# EAGLE design ll4-gun (EAGLE 5.10)
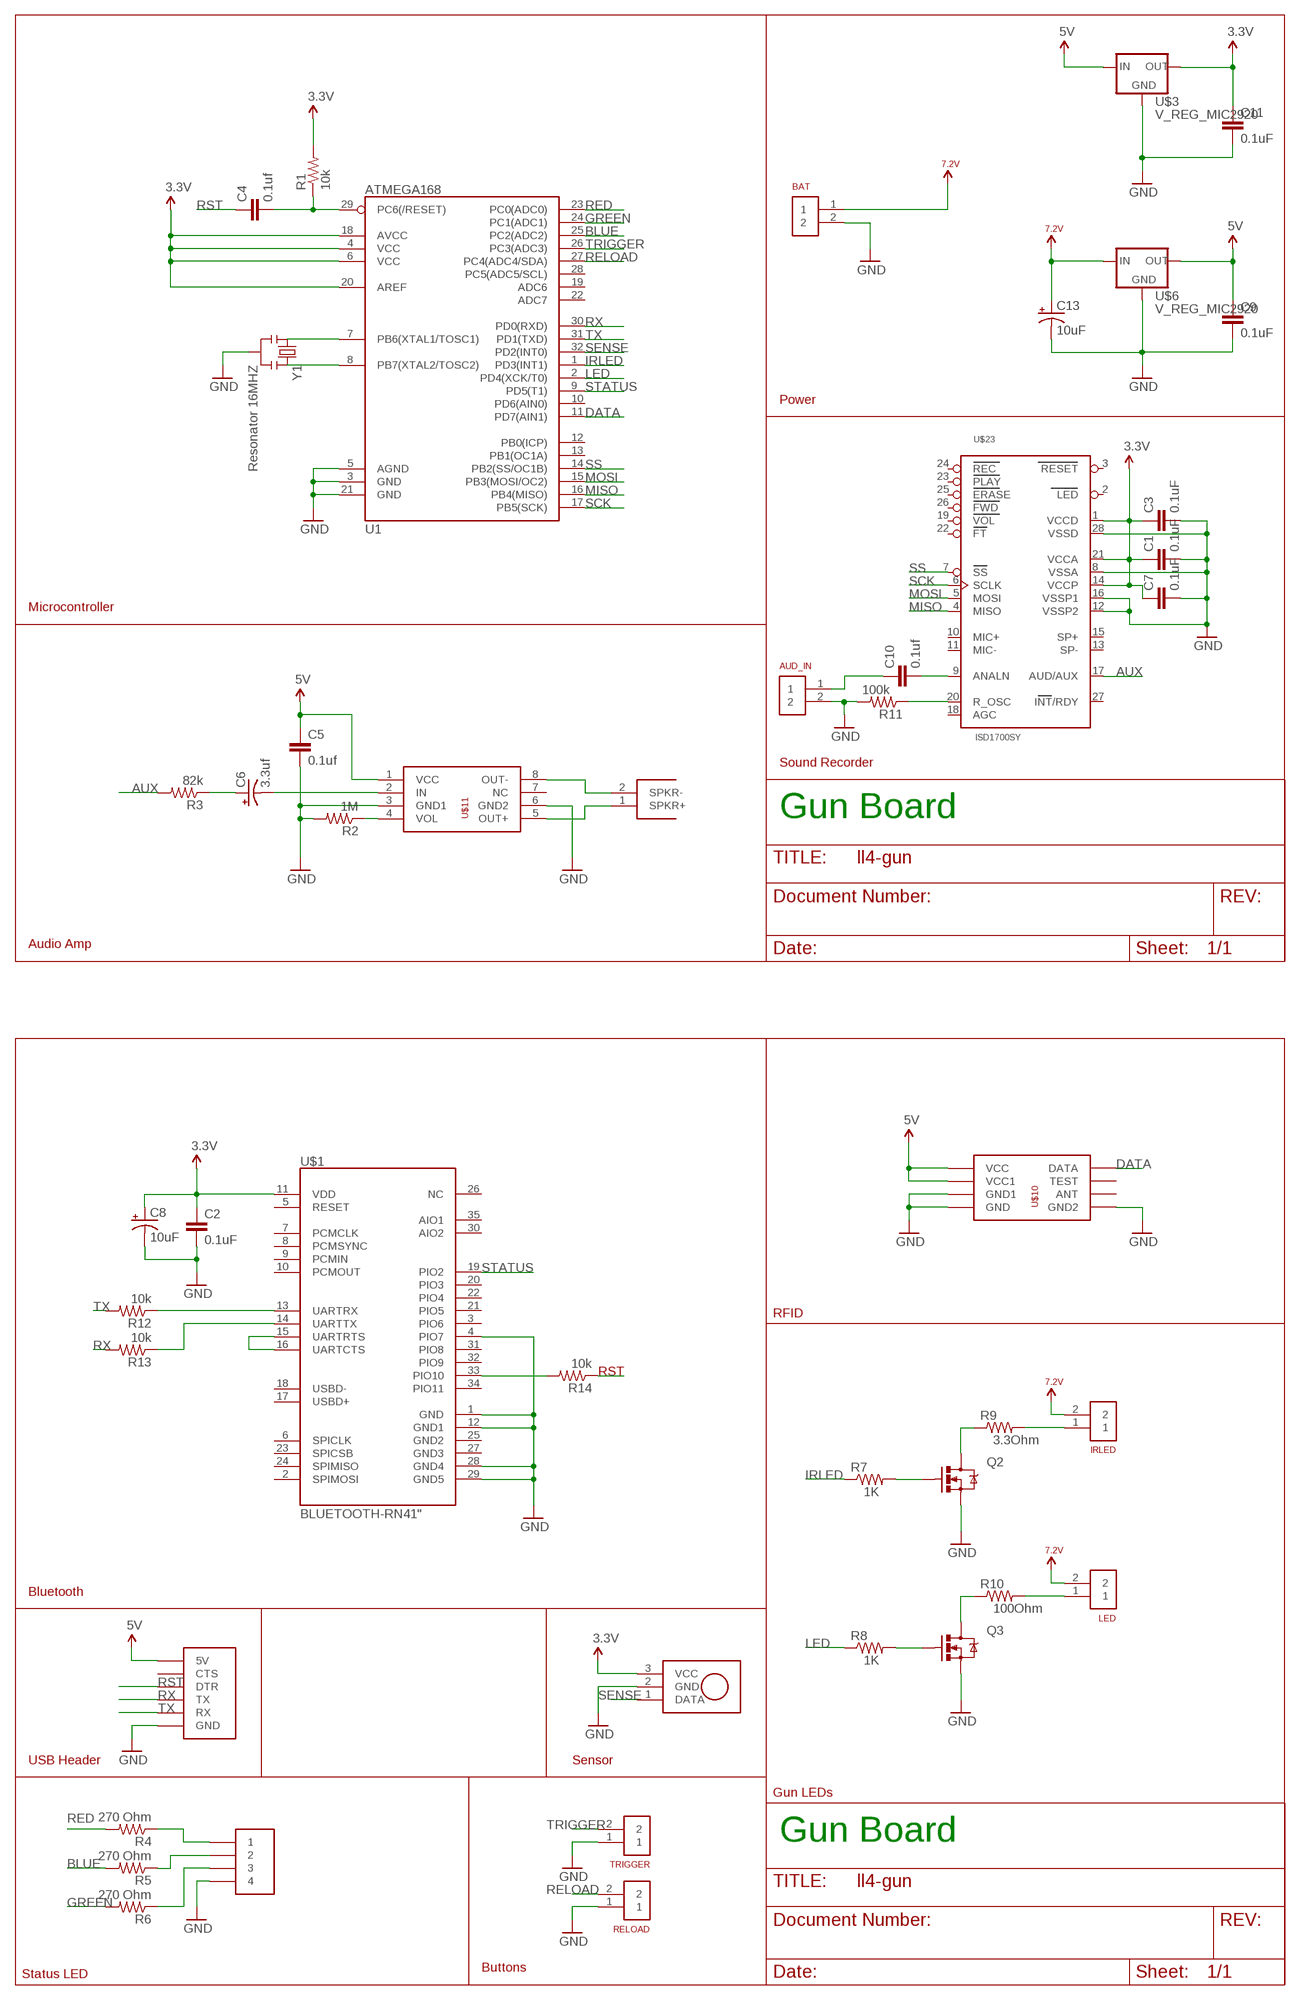
[diagram p0: schematic, sheet 1]

## Parts
AUD_IN  2HEAD  [2HEAD]
BAT  2HEAD  [2HEAD]
C1  0.1uF  CAP0805  [0805]
C2  0.1uF  CAP0805  [0805]
C3  0.1uF  CAP0805  [0805]
C4  0.1uf  CAP0805  [0805]
C5  0.1uf  CAP0805  [0805]
C6  3.3uf  CAP_POL1206-KIT  [EIA3216-KIT]
C7  0.1uF  CAP0805  [0805]
C8  10uF  CAP_POL1206  [EIA3216]
C9  0.1uF  CAP0805  [0805]
C10  0.1uf  CAP0805  [0805]
C11  0.1uF  CAP0805  [0805]
C13  10uF  CAP_POL1206  [EIA3216]
IRLED  2HEAD  [2HEAD]
LED  2HEAD  [2HEAD]
Q2  MOSFET-NCHANNELSMD  [SOT23-3]
Q3  MOSFET-NCHANNELSMD  [SOT23-3]
R1  10k  RESISTOR0805-RES  [0805]
R2  1M  RESISTOR0805-RES  [0805]
R3  82k  RESISTOR0805-RES  [0805]
R4  270 Ohm  RESISTOR0805-RES  [0805]
R5  270 Ohm  RESISTOR0805-RES  [0805]
R6  270 Ohm  RESISTOR0805-RES  [0805]
R7  1K  RESISTOR0805-RES  [0805]
R8  1K  RESISTOR0805-RES  [0805]
R9  3.3Ohm  RESISTORPTH-1/2W  [AXIAL-0.5]
R10  100Ohm  RESISTORPTH-1/2W  [AXIAL-0.5]
R11  100k  RESISTOR0805-RES  [0805]
R12  10k  RESISTOR0805-RES  [0805]
R13  10k  RESISTOR0805-RES  [0805]
R14  10k  RESISTOR0805-RES  [0805]
RELOAD  2HEAD  [2HEAD]
SPEAKER  SPKRHEAD  [SPKRHEAD]
TRIGGER  2HEAD  [2HEAD]
U1  ATMEGA168  [TQFP32-08]
U$1  BLUETOOTH-RN41"  [RN41]
U$3  V_REG_MIC2920  [SOT223]
U$6  V_REG_MIC2920  [SOT223]
U$10  RFLINK-RCV  [RFLINK-RCV]
U$11  TDA7052B  [DIP08]
U$13  TSOP48XX  [TSOP48XX]
U$16  4HEAD  [4HEAD]
U$20  USBHEAD  [USBHEAD]
U$23  ISD1700SY  [SO28W]
Y1  Resonator 16MHZ  RESONATORPTH  [RESONATOR-PTH]

## Nets
3.3V: C1.1 C2.1 C3.1 C7.1 C8.A(+) C11.1 R1.2 U1.4(VCC) U1.6(VCC) U1.18(AVCC) U1.20(AREF) U$1.11(VDD) U$3.3(OUT) U$13.3(VCC) U$23.1(VCCD) U$23.14(VCCP) U$23.21(VCCA)
5V: C5.1 C9.1 U$3.1(IN) U$6.3(OUT) U$10.VCC1(VCC) U$10.VCC(VCC1) U$11.1(VCC) U$20.3(5V)
7.2V: BAT.1 C13.A(+) IRLED.2 LED.2 U$6.1(IN)
AUX: R3.2 U$23.17(AUD/AUX)
BLUE: R5.2 U1.25(PC2(ADC2))
DATA: U1.11(PD7(AIN1)) U$10.DATA
GND: AUD_IN.2 BAT.2 C1.2 C2.2 C3.2 C5.2 C7.2 C8.C(-) C9.2 C11.2 C13.C(-) Q2.2(S) Q3.2(S) R2.2 R11.2 RELOAD.1 TRIGGER.1 U1.3(GND) U1.5(AGND) U1.21(GND) U$1.1(GND) U$1.4(PIO7) U$1.12(GND1) U$1.28(GND4) U$1.29(GND5) U$3.2(GND) U$6.2(GND) U$10.GND1(GND2) U$10.GND2(GND) U$10.GND(GND1) U$11.3(GND1) U$11.6(GND2) U$13.2(GND) U$16.4 U$20.1(GND) U$23.8(VSSA) U$23.12(VSSP2) U$23.16(VSSP1) U$23.28(VSSD) Y1.2
GREEN: R6.2 U1.24(PC1(ADC1))
IRLED: R7.1 U1.1(PD3(INT1))
LED: R8.1 U1.2(PD4(XCK/T0))
LINK: U$1.15(UARTRTS) U$1.16(UARTCTS)
MISO: U1.16(PB4(MISO)) U$23.4(MISO)
MOSI: U1.15(PB3(MOSI/OC2)) U$23.5(MOSI)
N$1: U1.7(PB6(XTAL1/TOSC1)) Y1.1
N$2: U1.8(PB7(XTAL2/TOSC2)) Y1.3
N$3: R12.1 U$1.13(UARTRX)
N$4: SPEAKER.2(SPKR-) U$11.8(OUT-)
N$5: SPEAKER.1(SPKR+) U$11.5(OUT+)
N$6: R2.1 U$11.4(VOL)
N$7: C6.C(-) U$11.2(IN)
N$8: C6.A(+) R3.1
N$9: R13.1 U$1.14(UARTTX)
N$10: R4.1 U$16.1
N$11: R5.1 U$16.2
N$12: R6.1 U$16.3
N$13: C4.2 R1.1 U1.29(PC6(/RESET))
N$14: Q2.1(G) R7.2
N$15: Q3.1(G) R8.2
N$16: IRLED.1 R9.P$2
N$17: LED.1 R10.P$2
N$18: Q3.3(D) R10.P$1
N$19: R11.1 U$23.20(R_OSC)
N$20: Q2.3(D) R9.P$1
N$21: C10.2 U$23.9(ANALN)
N$22: AUD_IN.1 C10.1
N$23: R14.2 U$1.33(PIO10)
RED: R4.2 U1.23(PC0(ADC0))
RELOAD: RELOAD.2 U1.27(PC4(ADC4/SDA))
RST: C4.1 R14.1 U$20.6(DTR)
RX: R13.2 U1.30(PD0(RXD)) U$20.4(TX)
SCK: U1.17(PB5(SCK)) U$23.6(SCLK)
SENSE: U1.32(PD2(INT0)) U$13.1(DATA)
SS: U1.14(PB2(SS/OC1B)) U$23.7(SS)
STATUS: U1.9(PD5(T1)) U$1.19(PIO2)
TRIGGER: TRIGGER.2 U1.26(PC3(ADC3))
TX: R12.2 U1.31(PD1(TXD)) U$20.5(RX)
Unconnected: U1.10(PD6(AIN0)) U1.12(PB0(ICP)) U1.13(PB1(OC1A)) U1.19(ADC6) U1.22(ADC7) U1.28(PC5(ADC5/SCL)) U$1.2(SPIMOSI) U$1.3(PIO6) U$1.5(RESET) U$1.6(SPICLK) U$1.7(PCMCLK) U$1.8(PCMSYNC) U$1.9(PCMIN) U$1.10(PCMOUT) U$1.17(USBD+) U$1.18(USBD-) U$1.20(PIO3) U$1.21(PIO5) U$1.22(PIO4) U$1.23(SPICSB) U$1.24(SPIMISO) U$1.25(GND2) U$1.26(NC) U$1.27(GND3) U$1.30(AIO2) U$1.31(PIO8) U$1.32(PIO9) U$1.34(PIO11) U$1.35(AIO1) U$10.ANT U$10.TEST U$11.7(NC) U$20.2(CTS) U$23.2(LED) U$23.3(RESET) U$23.10(MIC+) U$23.11(MIC-) U$23.13(SP-) U$23.15(SP+) U$23.18(AGC) U$23.19(VOL) U$23.22(FT) U$23.23(PLAY) U$23.24(REC) U$23.25(ERASE) U$23.26(FWD) U$23.27(INT/RDY)

## Notes on the sheet
- Power
- Microcontroller
- Sound Recorder
- Gun Board
- Audio Amp
- RFID
- Bluetooth
- USB Header | Sensor
- Gun LEDs
- Gun Board
- Buttons
- Status LED

## Library data of the parts
AUD_IN BAT IRLED LED RELOAD TRIGGER = custom:2HEAD
C1-C5 C7 C9-C11 = sparkfun:CAP: Capacitor Standard 0603 ceramic capacitor, and 0.1" leaded capacitor.
C6 C8 C13 = sparkfun:CAP_POL: Capacitor Polarized These are standard SMD and PTH capacitors. Normally 10uF, 47uF, and 100uF in electrolytic and tantalum varieties. Always verify the external diameter of the through hole cap, it varies with capacity, voltage, and manufacturer. The EIA devices should be standard.
Q2 Q3 = sparkfun:MOSFET-NCHANNEL
R1-R14 = sparkfun:RESISTOR: Resistor Basic schematic elements and footprints for 0603, 1206, and PTH resistors.
SPEAKER = custom:SPKRHEAD
U1 = sparkfun:ATMEGA168
U$1 = sparkfun:BLUETOOTH-RN41
U$3 U$6 = sparkfun:V_REG_MIC2920: MIC2920A (http://www.micrel.com/_PDF/mic2920.pdf) - 400mA output LDO Regulator
U$10 = custom:RFLINK-RCV
U$11 = custom:TDA7052B
U$13 = custom:TSOP48XX
U$16 = custom:4HEAD
U$20 = custom:USBHEAD
U$23 = isd-new-1:ISD1700
Y1 = sparkfun:RESONATOR: Resonator Small SMD resonator. This is the itty bitty 10/20MHz resonators with built in caps. CSTCE10M0G55 and CSTCE20M0V53. Footprint has been reviewed closely but hasn't been tested yet.

## Board
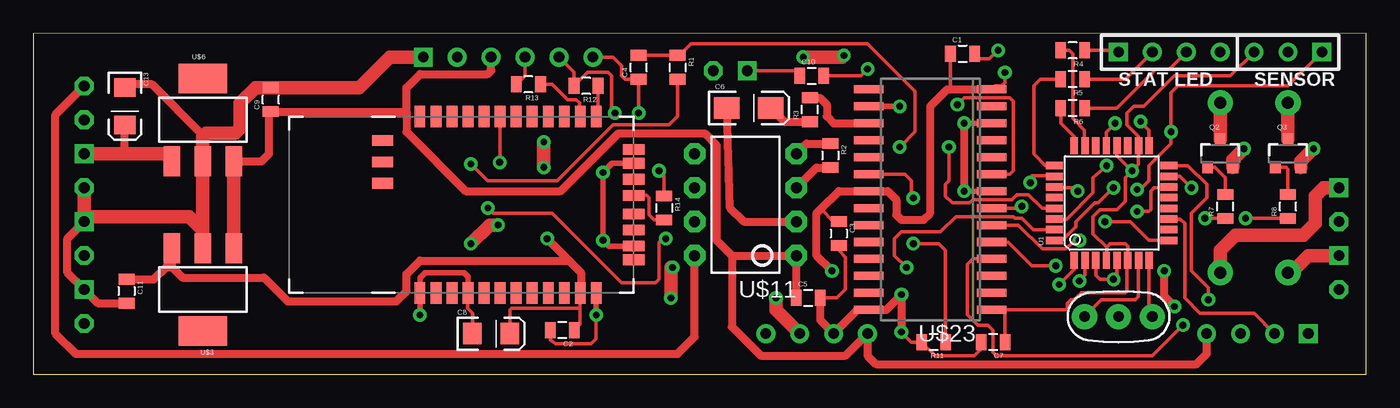
[diagram p1: board, top side]
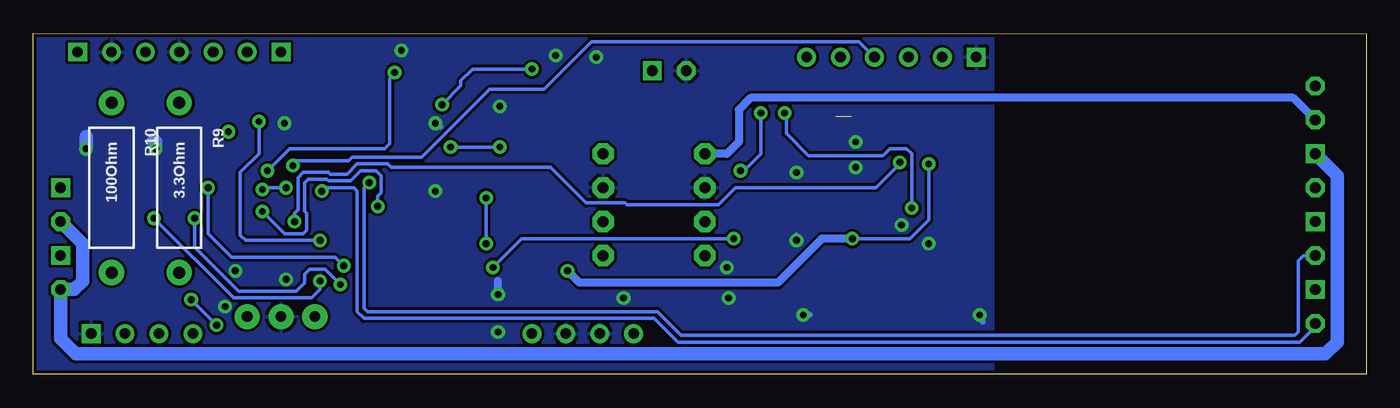
[diagram p2: board, bottom side, seen from below]

Size 99.83 x 25.53 mm. Coordinates in mm from the lower left corner, seen from the top.
Outline: 0,0 99.83,0 99.83,25.53 0,25.52 0,0
Copper layers (1*16): Top 0.035mm / dielectric 1.5mm / Bottom 0.035mm
Design rules "SparkFun": minimum track width 8mil, minimum drill 20mil, track to track 8mil, track to pad 8mil, pad to pad 8mil, via to via 8mil, smd to smd 8mil, copper to edge 10mil, drill to drill 8mil, minimum pad ring 12mil, minimum via ring 10mil, stop-mask expansion 4mil, vias tented up to drill 25mil, thermal gap 10mil

### Footprints (pad centres in the part's own frame; a part is rotated, then mirrored left to right if it is on the bottom)
2HEAD = drill 0.8 square: 1 -1.27,0 | drill 0.8 octagon: 2 1.27,0
0805 = smd 0.8 x 1.2: 1 -0.9,0; 2 0.9,0
EIA3216-KIT = smd 1.9 x 1.6: A 1.65,0; C -1.65,0
EIA3216 = smd 1.4 x 1.6: A 1.4,0; C -1.4,0
SOT23-3 = smd 0.8 x 0.9: 1 -0.95,-1; 2 0.95,-1; 3 0,1.1
AXIAL-0.5 = drill 0.9 pad 1.88 round: P$1 -6.35,0; P$2 6.35,0
SPKRHEAD = drill 0.8 octagon: 1 -1.27,0; 2 1.27,0
TQFP32-08 = smd 1.27 x 0.559: 1 -4.293,2.8; 2 -4.293,2; 3 -4.293,1.2; 4 -4.293,0.4; 5 -4.293,-0.4; 6 -4.293,-1.2; 7 -4.293,-2; 8 -4.293,-2.8; 17 4.293,-2.8; 18 4.293,-2; 19 4.293,-1.2; 20 4.293,-0.4; 21 4.293,0.4; 22 4.293,1.2; 23 4.293,2; 24 4.293,2.8 | smd 0.559 x 1.27: 9 -2.8,-4.293; 10 -2,-4.293; 11 -1.2,-4.293; 12 -0.4,-4.293; 13 0.4,-4.293; 14 1.2,-4.293; 15 2,-4.293; 16 2.8,-4.293; 25 2.8,4.293; 26 2,4.293; 27 1.2,4.293; 28 0.4,4.293; 29 -0.4,4.293; 30 -1.2,4.293; 31 -2,4.293; 32 -2.8,4.293
RN41 = smd 0.8 x 1.6: 1 -6.6,-6.6; 2 -5.4,-6.6; 3 -4.2,-6.6; 4 -3,-6.6; 5 -1.8,-6.6; 6 -0.6,-6.6; 7 0.6,-6.6; 8 1.8,-6.6; 9 3,-6.6; 10 4.2,-6.6; 11 5.4,-6.6; 12 6.6,-6.6; 13 6.6,6.6; 14 5.4,6.6; 15 4.2,6.6; 16 3,6.6; 17 1.8,6.6; 18 0.6,6.6; 19 -0.6,6.6; 20 -1.8,6.6; 21 -3,6.6; 22 -4.2,6.6; 23 -5.4,6.6; 24 -6.6,6.6 | smd 1.6 x 0.8: 25 -9.4,4.8; 26 -9.4,3.2; 27 -9.4,1.6; 28 9.4,3.1; 29 9.4,-3.1; 30 9.4,-4.122; 31 9.4,-1.9; 32 9.4,-0.7; 33 9.4,0.7; 34 9.4,1.9; 35 9.4,4.122
SOT223 = smd 1.219 x 2.235: 1 -2.311,-3.099; 2 0,-3.099; 3 2.311,-3.099 | smd 3.6 x 2.2: 4 0,3.099
RFLINK-RCV = drill 0.8 round: ANT 21.59,0; DATA -16.51,0; GND1 16.51,0; GND2 19.05,0; TEST -13.97,0; VCC -11.43,0; VCC1 13.97,0 | drill 0.8 square: GND -19.05,0
DIP08 = drill 0.813 pad 1.6 octagon: 1 -3.81,-3.81; 2 -1.27,-3.81; 3 1.27,-3.81; 4 3.81,-3.81; 5 3.81,3.81; 6 1.27,3.81; 7 -1.27,3.81; 8 -3.81,3.81
TSOP48XX = drill 0.8 square: 1 -2.54,0 | drill 0.8 round: 2 0,0; 3 2.54,0
4HEAD = drill 0.8 square: 1 -3.81,0 | drill 0.8 round: 2 -1.27,0; 3 1.27,0; 4 3.81,0
USBHEAD = drill 0.8 square: 1 -6.35,0 | drill 0.8 round: 2 -3.81,0; 3 -1.27,0; 4 1.27,0; 5 3.81,0; 6 6.35,0
SO28W = smd 0.6 x 2.2: 1 -8.255,-4.6; 2 -6.985,-4.6; 3 -5.715,-4.6; 4 -4.445,-4.6; 5 -3.175,-4.6; 6 -1.905,-4.6; 7 -0.635,-4.6; 8 0.635,-4.6; 9 1.905,-4.6; 10 3.175,-4.6; 11 4.445,-4.6; 12 5.715,-4.6; 13 6.985,-4.6; 14 8.255,-4.6; 15 8.255,4.6; 16 6.985,4.6; 17 5.715,4.6; 18 4.445,4.6; 19 3.175,4.6; 20 1.905,4.6; 21 0.635,4.6; 22 -0.635,4.6; 23 -1.905,4.6; 24 -3.175,4.6; 25 -4.445,4.6; 26 -5.715,4.6; 27 -6.985,4.6; 28 -8.255,4.6
RESONATOR-PTH = drill 0.8 pad 1.88 round: 1 -2.54,0; 2 0,0; 3 2.54,0

### Placement (x,y rotation side)
AUD_IN  52.2,22.73 180 top
BAT  3.81,15.24 270 top
C1  69.6,24 0 top
C2  39.62,3.3 180 top
C3  60.33,10.54 270 top
C4  45.34,22.99 90 top
C5  58.04,5.71 0 top
C6  53.59,19.94 0 top
C7  71.88,2.41 180 top
C8  34.29,3.05 0 top
C9  17.78,20.57 90 top
C10  58.29,22.35 0 top
C11  6.99,6.22 270 top
C13  6.86,20.07 270 top
IRLED  97.79,12.7 270 bottom
LED  97.79,7.62 270 bottom
Q2  88.9,16.51 0 top
Q3  93.98,16.51 0 top
R1  48.26,22.99 270 top
R2  59.69,16.38 270 top
R3  58.17,19.81 90 top
R4  77.85,24.26 180 top
R5  77.85,22.1 180 top
R6  77.85,19.94 180 top
R7  89.28,12.57 90 top
R8  93.98,12.57 90 top
R9  88.9,13.97 270 bottom
R10  93.98,13.97 270 bottom
R11  67.44,2.41 180 top
R12  41.4,21.59 180 top
R13  37.08,21.72 180 top
R14  47.24,12.45 270 top
RELOAD  3.81,5.08 270 top
SPEAKER  3.81,20.32 90 top
TRIGGER  3.81,10.16 270 top
U1  80.77,12.83 90 top
U$1  35.56,12.7 0 top
U$3  12.7,6.35 180 top
U$6  12.7,19.05 0 top
U$10  76.45,3.05 0 bottom
U$11  53.34,12.7 90 top
U$13  93.98,24.13 180 top
U$16  85.09,24.13 0 top
U$20  35.56,23.75 0 top
U$23  67.18,13.08 90 top
Y1  81.28,4.32 0 top

### Tracks (layer width: path | path; a pad name or v marks a point on that pad's centre or on a via)
3.3V  (via drill 0.51)
  Top 0.254: 80.39,9.53 80.64,9.78 81.79,9.78 81.97,9.6 U1.6 81.92,8.48 81.92,6.22 81.79,6.1 78.49,6.1 77.98,5.59 77.72,5.59 77.47,5.33 77.47,4.83 72.52,4.83 | 80.39,9.53 80.39,8.55 U1.4 | v82.3,15.24 82.77,15.72 U1.18 82.77,17.81 81.92,18.67 81.92,19.56 82.42,20.07 83.19,20.07 85.47,22.35 89.66,22.35 U$13.3 | U$1.11 40.96,4.95 | 40.96,4.95 40.96,3.74 C2.1 | 71.64,4.68 U$23.1 72.52,4.83 | C1.1 68.7,21.35 68.71,21.34 | C3.1 59.93,11.44 58.99,12.38 | 80.39,9.53 79.38,10.54 79.38,11.81 79.88,12.32 81.15,12.32 81.79,12.95 81.79,14.73 v82.3,15.24 | C8.A 35.69,4.83 35.81,4.95 40.96,4.95 | 81.15,17.1 81.15,16.38 v82.3,15.24 | v72.77,22.61 72.77,21.84 72.52,21.59 72.04,21.59 U$23.14 | R1.2 48.26,19.3 47.62,18.67 43.43,18.67 39.24,14.48 34.04,14.48 v32.77,15.75 | C7.1 72.78,4.56 72.52,4.83
  Top 0.406: 81.15,17.1 U1.20
  Top 0.61: 10.39,8.03 U$3.3 | 10.39,8.03 11.18,7.24 17.27,7.24 19.05,5.46 27.18,5.46 27.94,6.22 27.94,7.49 28.96,8.51 40.13,8.51 | 40.13,8.51 41.02,7.62 41.02,6.16 U$1.11 | 10.39,8.03 9.93,8.03 9.02,7.11 7.76,7.11 C11.1 | 40.13,8.51 v38.48,10.16 | U$23.14 68.71,21.34 68.45,21.34 67.18,20.07 67.18,12.06 66.67,11.56 65.02,11.56 64.64,11.94 64.64,13.08 64.01,13.72 U$23.21 60.33,13.72 58.99,12.38 58.67,12.06 58.67,8.89 v59.82,7.75
  Bottom 0.254: v82.3,15.24 80.64,16.89 73.53,16.89 73.15,17.27 73.15,22.1 v72.77,22.61 | v32.77,15.75 32.77,11.56 34.16,10.16 v38.48,10.16
  Bottom 0.61: v38.48,10.16 40.77,10.16 44.07,6.86 58.93,6.86 v59.82,7.75
5V
  Top 0.61: 52.32,8.89 51.18,10.03 51.18,17.14 50.29,18.03 43.81,18.03 39.5,13.72 32.38,13.72 27.94,18.16 27.94,19.68 | 52.32,8.89 U$11.1 57.14,8.88 C5.1 | 52.32,8.89 52.32,3.56 54.48,1.4 60.83,1.4 U$10.VCC1 62.48,1.4 63.12,0.76 87.12,0.76 87.88,1.52 U$10.VCC | U$20.3 34.29,22.73 34.04,22.48 28.96,22.48 27.94,21.46 27.94,19.68 | U$6.3 17.09,15.95 17.65,16.51 17.65,19.55 C9.1 27.93,19.67 27.94,19.68
  Top 1.016: U$3.1 U$6.3
7.2V
  Top 0.61: 6.86,16.51 C13.A
  Top 1.016: BAT.1 6.86,16.51 9.83,16.51 U$6.1
  Bottom 1.016: IRLED.2 96.14,9.78 96.14,6.99 96.77,6.35 LED.2 97.79,2.67 96.65,1.52 3.05,1.52 2.16,2.41 2.16,14.86 BAT.1
AUX
  Top 0.61: U$23.17 59.94,18.8 59.44,19.3 59.44,20.19 58.93,20.7 58.05,20.7 R3.2
BLUE
  Top 0.254: U1.25 75.82,15.62 74.93,16.51 74.93,21.59 75.44,22.1 R5.2
DATA
  Top 0.254: U1.11 85.91,11.63 86.23,11.3 86.23,5.71 87.38,4.57 91.44,4.57 U$10.DATA
GND  (via drill 0.51)
  Top 0.254: U1.5 81.17,7.38 v80.9,7.11 79.88,7.11 79.57,7.42 U1.3 | U1.21 80.37,18.14 v81.03,18.8 | C2.2 38.72,2.55 39.12,2.29 41.78,2.29 42.16,2.67 v42.16,4.45 | C3.2 60.33,9.27 60.83,8.76 60.83,6.35 60.2,5.71 C5.2 | C8.C 32.89,4.58 32.51,4.95 32.51,6.05 U$1.4 | C1.2 70.75,23.62 71.63,23.62 v72.26,24.26 | v65.02,3.17 65.79,2.41 R11.2 67.55,1.4 70.48,1.4 70.98,1.89 C7.2
  Top 0.406: U$1.28 43.36,15.8 v42.67,15.11 v42.67,10.03 43.1,9.6 U$1.29 | U$1.12 v42.16,4.45 | U$1.4 32.56,7.32 32.26,7.62 29.34,7.62 28.96,7.24 U$1.1 v28.96,4.45 | U$23.16 v64.9,20.07 | v69.72,18.8 U$23.12 | v69.72,13.72 U$23.8
  Top 0.61: C11.2 6.97,5.33 4.83,5.33 RELOAD.1 2.54,7.62 2.54,10.16 TRIGGER.1 | 12.95,18.03 12.7,17.78 12.7,17.91 8.89,21.72 6.86,21.72 C13.C | C5.2 58.94,4.05 U$10.GND1 61.72,4.83 U$23.28 63.88,4.83 v65.02,5.97 v65.02,3.17 | R2.2 58.66,15.48 U$11.3 | v69.72,13.72 v69.72,18.8 | v84.71,7.75 84.71,5.84 v85.47,5.08
  Top 1.016: 12.7,10.79 U$3.2 | 12.7,10.79 U$6.2 12.7,17.78 | 12.7,10.79 11.68,11.81 4.19,11.81 TRIGGER.1 BAT.2 | 12.95,18.03 15.11,18.03 15.49,18.41 15.49,20.32 16.65,21.47 C9.2 24.39,21.47 26.67,23.75 U$20.1 | Q2.2 89.85,16.06 v90.68,16.89 | Q3.2 94.93,15.94 v95.89,16.89 | v57.66,23.75 60.58,23.75 v60.71,23.88 | v47.88,8 47.75,8 v47.75,5.71 | v55.63,5.71 55.63,4.83 U$10.GND2 | v38.23,15.49 v38.23,17.4 | v34.8,11.18 34.16,11.18 v32.77,9.78
  Bottom 0.254: v80.9,7.11 80.77,7.11 80.64,6.99 | v81.03,18.8 81.28,18.67 | v72.26,24.26 72.52,24.26
  Bottom 0.406: v42.67,10.03 42.67,10.41 | v42.16,4.45 41.66,4.45 | v28.96,4.45 28.96,4.19 28.7,3.94 | v64.9,20.07 65.02,20.07 | v69.72,18.8 69.72,18.67 69.34,18.54
  Bottom 0.61: v65.02,5.97 65.02,6.99
  Bottom 1.016: v90.68,16.89 90.68,17.4 90.81,17.53 | v95.89,16.89 95.89,17.78
  pour Bottom (isolate 0.12): 27.94,25.4 99.83,25.4 99.83,0 27.94,0
GREEN
  Top 0.254: U1.24 77.97,17.79 76.96,18.8 76.96,19.93 R6.2
IRLED  (via drill 0.51)
  Top 0.254: R7.1 v87.77,11.67 v87.76,11.68 | U1.1 77.97,7.87 v76.83,6.73
  Bottom 0.254: v87.76,11.68 87.76,9.53 84.45,6.22 80.14,6.22 79.5,6.86 79.5,7.49 79.12,7.87 77.98,7.87 v76.83,6.73
LED  (via drill 0.51)
  Top 0.254: U1.2 78.77,7.4 v78.36,6.99 | v90.81,11.68 93.97,11.68 R8.1
  Bottom 0.254: v78.36,6.99 78.36,6.35 78.99,5.71 84.84,5.71 v90.81,11.68
LINK  (1 unrouted)
MISO  (via drill 0.51)
  Top 0.254: U$23.4 70.36,8.64 69.98,8.26 69.98,4.45 70.74,3.68 71.5,3.68 71.88,3.3 71.88,1.65 72.14,1.4 83.82,1.4 v86.11,3.68 | v88.01,5.59 88.01,6.48 86.74,7.75 86.74,12.06 87.88,13.21 87.88,14.22 86.49,15.62 U1.16
  Bottom 0.254: v86.11,3.68 v88.01,5.59
MOSI  (via drill 0.51)
  Top 0.254: U1.15 85.88,14.83 v86.74,13.97 | U$23.5 73.03,9.91 74.8,8.13 v76.58,8.13
  Bottom 0.254: v86.74,13.97 86.74,10.54 84.96,8.76 77.22,8.76 v76.58,8.13
N$1
  Top 0.254: U1.7 82.77,5.81 82.55,5.59 80.01,5.59 Y1.1
N$2
  Top 0.254: U1.8 83.57,4.57 Y1.3
N$3
  Top 0.254: R12.1 42.3,19.44 U$1.13
N$4
  Top 0.61: U$11.8 49.53,2.79 48.26,1.52 3.17,1.52 1.65,3.05 1.65,19.43 SPEAKER.2
N$5
  Bottom 0.61: U$11.5 47.88,16.51 46.99,17.4 46.99,19.81 46.1,20.7 5.46,20.7 SPEAKER.1
N$6
  Top 0.61: U$11.4 57.91,17.27 R2.1
N$7
  Top 0.61: C6.C 52.19,12.45 53.21,11.43 U$11.2
N$8
  Top 0.61: C6.A 56.26,18.92 57.77,18.92 R3.1
N$9
  Top 0.254: U$1.14 40.89,19.37 40.89,20.32 40.64,20.57 40.01,20.57 38.86,21.72 R13.1
N$10
  Top 0.254: R4.1 81.15,24.26 U$16.1
N$11
  Top 0.254: R5.1 81.79,22.1 U$16.2
N$12
  Top 0.254: R6.1 81.15,19.94 84.07,22.86 85.09,22.86 U$16.3
N$13  (via drill 0.51)
  Top 0.254: C4.2 R1.1 48.4,23.89 49.28,24.77 62.48,24.77 66.04,21.21 66.04,18.16 v64.9,17.02 | v68.58,17.02 68.58,14.48 68.33,14.22 68.33,13.34 68.83,12.83 70.1,12.83 70.36,13.08 73.28,13.08 73.66,13.46 74.55,13.46 75.56,12.45 76.46,12.45 U1.29
  Bottom 0.254: v64.9,17.02 v68.58,17.02
N$14
  Top 0.254: Q2.1 88.5,15.51 89.28,14.73 R7.2
N$15
  Top 0.254: Q3.1 93.84,15.51 93.98,15.37 R8.2
N$16
  Top 1.016: R9.P$2 88.9,9.27 90.04,10.41 95.12,10.41 96.01,11.3 96.01,13.34 96.65,13.97 IRLED.1
N$17
  Top 1.016: R10.P$2 94.23,7.62 95.5,8.89 LED.1
N$18
  Top 1.016: Q3.3 R10.P$1
N$19  (via drill 0.51)
  Top 0.254: U$23.20 65.28,14.99 65.79,14.48 65.79,13.34 v65.91,13.21 | v65.91,9.78 67.82,9.78 68.33,9.27 68.33,3.06 R11.1
  Bottom 0.254: v65.91,9.78 v65.91,13.21
N$20
  Top 1.016: Q2.3 R9.P$1
N$21  (via drill 0.51)
  Top 0.254: U$23.9 73.15,14.99 73.41,15.24 73.41,20.45 73.15,20.7 69.72,20.7 v69.22,20.19 | C10.2 61.98,22.35 v62.48,22.86
  Bottom 0.254: v62.48,22.86 66.93,22.86 67.82,21.97 67.82,21.59 v69.22,20.19
N$22
  Top 0.254: AUD_IN.1 57.01,22.73 C10.1
N$23
  Top 0.254: U$1.33 45.91,13.4 46.1,13.21 46.1,11.94 46.48,11.56 R14.2
RED
  Top 0.254: R4.2 77.6,24.26 77.85,24 77.85,19.18 78.74,18.29 78.74,17.15 U1.23
RELOAD  (via drill 0.51)
  Top 0.254: v78.23,13.72 77.98,13.97 76.54,13.97 U1.27
  Bottom 0.254: v78.23,13.72 77.98,13.97 75.82,13.97 75.56,13.72 75.56,4.7 75.06,4.19 53.34,4.19 51.56,2.41 4.95,2.41 3.81,3.56 RELOAD.2
RST  (via drill 0.51)
  Top 0.254: U$20.6 43.43,23.75 44.07,23.11 44.07,22.35 44.32,22.1 45.33,22.1 C4.1 v45.34,19.56 | R14.1 47.24,14.86 v46.86,15.24
  Bottom 0.254: v46.86,15.24 46.61,15.24 45.34,16.51 v45.34,19.56
RX  (via drill 0.51)
  Top 0.254: U1.30 77.41,11.63 79.38,13.59 79.38,14.73 v80.39,15.62 | U$20.4 36.83,22.36 R13.2
  Bottom 0.254: v80.39,15.62 80.39,15.88 80.26,16 76.2,16 75.95,16.26 70.74,16.26 65.66,21.34 61.59,21.34 58.04,24.89 37.97,24.89 U$20.4
SCK  (via drill 0.51)
  Top 0.254: U1.17 83.57,18.28 v82.93,18.92 | U$23.6 73.79,11.18 75.56,9.4 77.34,9.4 77.85,9.91 78.23,9.91 v78.36,10.03
  Bottom 0.254: v82.93,18.92 82.93,16.51 84.33,15.11 84.33,10.41 83.95,10.03 v78.36,10.03
SENSE  (via drill 0.51)
  Top 0.254: U1.32 77.08,10.03 78.11,11.05 78.11,11.43 79.5,12.83 79.76,12.83 v80.9,13.97 | v82.68,13.84 82.93,13.84 83.57,14.48 83.57,15.62 85.22,17.27 v85.22,18.16 85.22,21.08 85.72,21.59 93.98,21.59 U$13.1
  Bottom 0.254: v80.9,13.97 82.55,13.97 v82.68,13.84
SS  (via drill 0.51)
  Top 0.254: U$23.7 73.91,12.45 v74.04,12.57 | v82.68,12.19 83.57,12.19 83.69,12.32 83.69,13.72 83.95,13.97 85.01,13.97 U1.14
  Bottom 0.254: v74.04,12.57 74.04,13.34 73.79,13.59 73.79,14.86 74.17,15.24 75.31,15.24 76.07,14.48 77.72,14.48 77.85,14.61 79.25,14.61 79.5,14.35 79.5,12.19 79.38,12.06 79.38,10.79 79.63,10.54 81.03,10.54 v82.68,12.19
STATUS  (via drill 0.51)
  Top 0.254: v80.26,11.43 82.17,11.43 83.57,10.03 U1.9 | U$1.19 34.96,15.91 v34.92,15.88
  Bottom 0.254: v34.92,15.88 34.92,15.75 36.7,13.97 47.24,13.97 48.51,12.7 55.37,12.7 55.5,12.83 58.42,12.83 61.09,15.49 73.03,15.49 73.28,15.75 75.56,15.75 76.33,14.99 77.6,14.99 77.72,15.11 79.63,15.11 80.01,14.73 80.01,12.32 80.26,12.06 v80.26,11.43
TRIGGER  (via drill 0.51)
  Top 0.254: 76.57,14.73 U1.26 76.45,14.86 74.8,14.86 74.68,14.73 v74.68,14.35
  Bottom 0.254: TRIGGER.2 4.7,8.89 5.08,8.51 5.08,3.17 5.33,2.92 51.31,2.92 53.09,4.7 74.8,4.7 75.06,4.95 75.06,13.97 v74.68,14.35
TX  (via drill 0.51)
  Top 0.254: U1.31 74.9,10.83 74.04,11.68 73.53,11.68 73.41,11.81 69.09,11.81 67.94,10.67 65.02,10.67 64.52,10.16 64.52,8.89 v65.41,8 | v34.04,12.45 34.42,12.06 38.86,12.06 44.07,6.86 46.61,6.86 46.86,7.11 46.86,9.91 47.12,10.16 v47.37,10.16 | v43.56,19.56 43.31,19.81 43.31,22.35 43.05,22.61 41.52,22.61 R12.2 40.5,22.62 U$20.5
  Bottom 0.254: v34.04,12.45 34.04,16.51 34.42,16.89 35.69,16.89 36.2,16.38 41.78,16.38 43.43,18.03 43.43,19.43 v43.56,19.56 | v65.41,8 63.25,10.16 v47.37,10.16

### Text on the board
tPlace: STAT LED | SENSOR
Name: USB | Spk | Mic | IR LED | Bat | Trig | Rld | LED | GUN BRD | V1